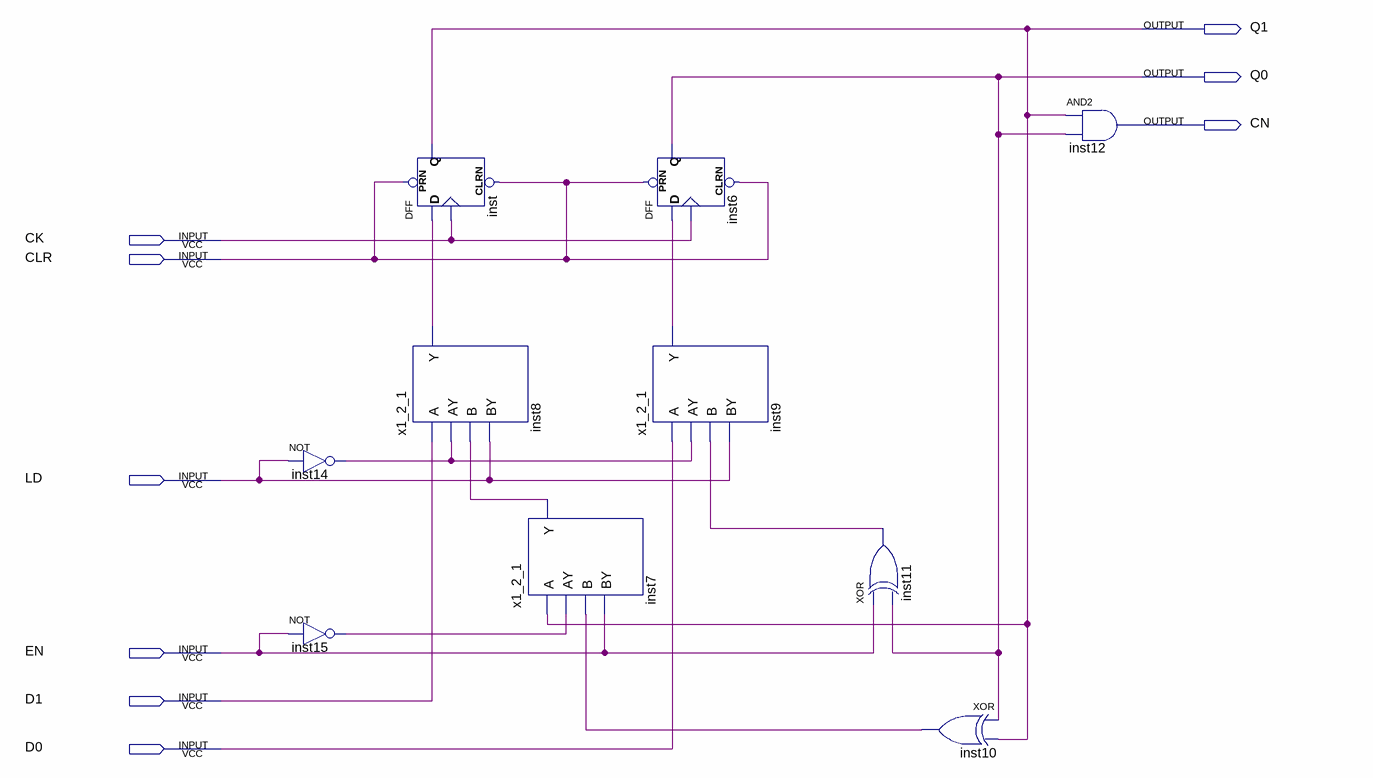
[diagram p0: schematic sheet]
// Quartus schematic count_4.bdf as structural Verilog: 10 symbols, 9 pins
module count_4 (
  input  CK,
  input  CLR,
  input  LD,
  input  EN,
  input  D1,
  input  D0,
  output Q1,
  output Q0,
  output CN
);

  wire inst7_y, inst8_y, inst9_y, inst10_out, inst11_out, inst14_out, inst15_out;

  not inst14 (inst14_out, LD);
  not inst15 (inst15_out, EN);
  DFF inst (.CLRN(CLR), .CLK(CK), .D(inst8_y), .PRN(CLR), .Q(Q1));
  x1_2_1 inst8 (.A(D1), .AY(inst14_out), .B(inst7_y), .BY(LD), .Y(inst8_y));
  x1_2_1 inst7 (.A(Q1), .AY(inst15_out), .B(inst10_out), .BY(EN), .Y(inst7_y));
  DFF inst6 (.CLRN(CLR), .CLK(CK), .D(inst9_y), .PRN(CLR), .Q(Q0));
  x1_2_1 inst9 (.A(D0), .AY(inst14_out), .B(inst11_out), .BY(LD), .Y(inst9_y));
  xor inst11 (inst11_out, EN, Q0);
  xor inst10 (inst10_out, Q0, Q1);
  and inst12 (CN, Q1, Q0);
endmodule
